# Altium schematic sheet WiFi.SchDoc
size A4
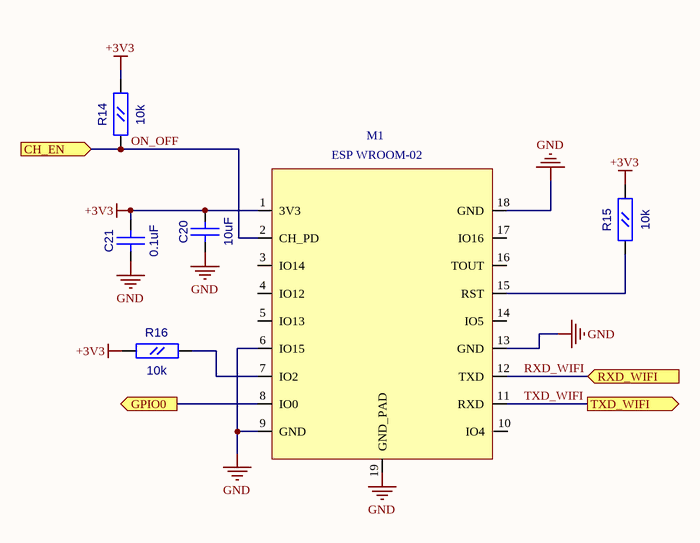
[diagram p0: WiFi.SchDoc]

## Parts
C20  10uF  [CC0805]
C21  0.1uF  [CC0603]
M1  ESP WROOM-02  [ESP-WOORM-02]
R14  10k  [RC0603]
R15  10k  [RC0603]
R16  10k  [RC0603]

## Ports
CH_EN (in), GPIO0 (out), RXD_WIFI (in), TXD_WIFI (out)

## Nets
+3V3: C20.2(B) C21.2(B) M1.1(3V3) R14.2(B) R15.2(B) R16.1(A)
GND: C20.1(A) C21.1(A) M1.6(IO15) M1.9(GND) M1.13(GND) M1.18(GND) M1.19(GND_PAD)
GPIO0: M1.8(IO0) ; port GPIO0
ON_OFF: M1.2(CH_PD) R14.1(A) ; port CH_EN
RXD_WIFI: M1.12(TXD) ; port RXD_WIFI
TXD_WIFI: M1.11(RXD) ; port TXD_WIFI
NetM1_7: M1.7(IO2) R16.2(B)
NetM1_15: M1.15(RST) R15.1(A)

Not connected (* = marked no-connect by the designer): M1 3(IO14) 4(IO12) 5(IO13) 10(IO4) 14(IO5) 16(TOUT) 17(IO16)

## Library data of the parts
C20 = CC0805: Value: 10uF
C21 = CC0603: Value: 0.1uF
M1 = ESP-WROOM-02: Value: ESP WROOM-02
R14-R16 = RC0603: Value: 10k